# EAGLE design MiniKeyb (EAGLE 7.7.0)
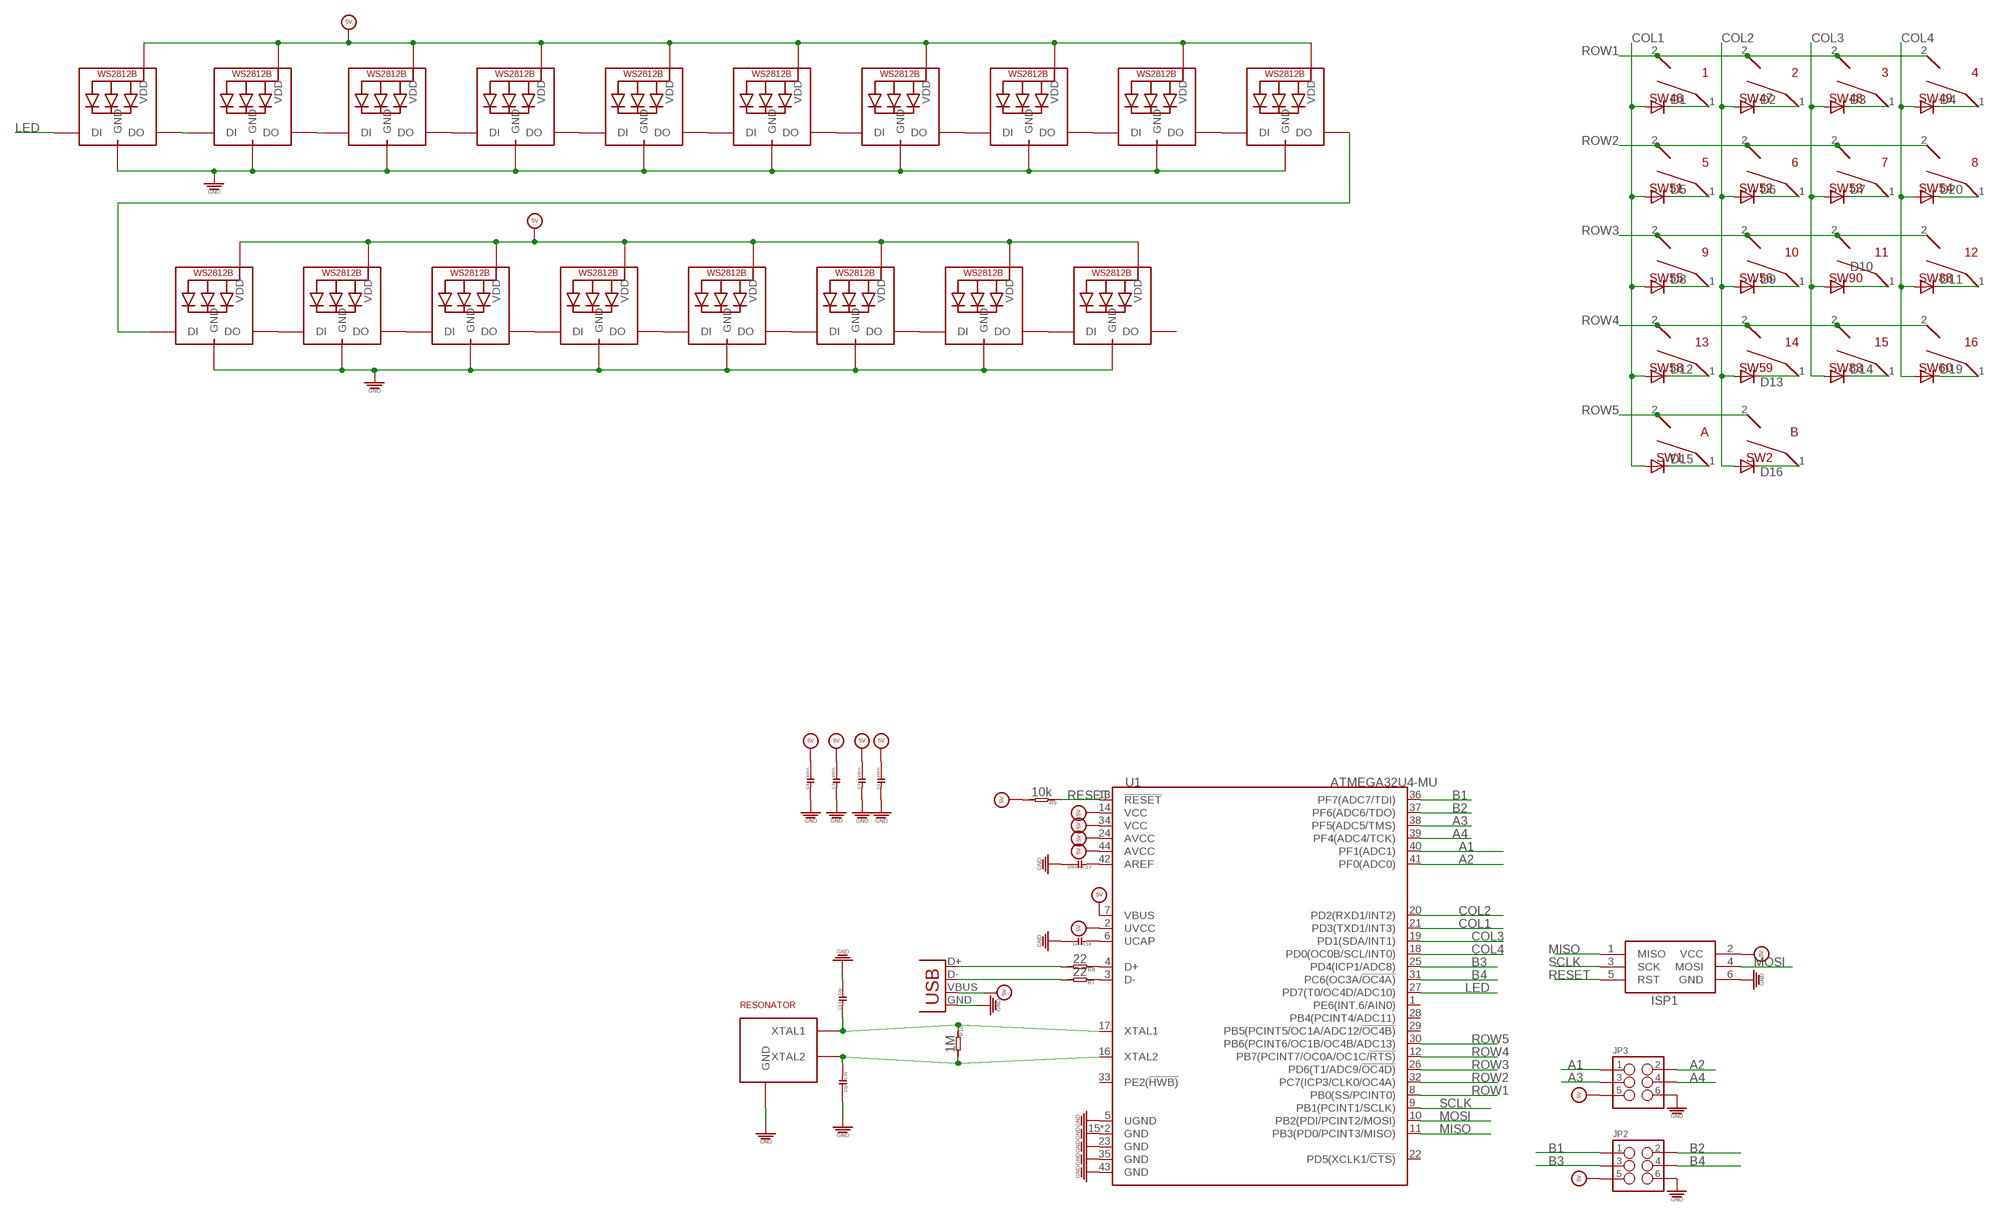
[diagram p0: schematic, sheet 1]

## Parts
C1  100n  C-0603  [C0603]
C2  100n  C-0603  [C0603]
C3  100n  C-0603  [C0603]
C4  100n  C-0603  [C0603]
C13  100n  C-0603  [C0603]
C14  1u  C-0603  [C0603]
C15  22p  C-0603  [C0603]
C16  22p  C-0603  [C0603]
D1  CGRM4001-G  [SOD-123_MINI-SMA]
D2  CGRM4001-G  [SOD-123_MINI-SMA]
D3  CGRM4001-G  [SOD-123_MINI-SMA]
D4  CGRM4001-G  [SOD-123_MINI-SMA]
D5  CGRM4001-G  [SOD-123_MINI-SMA]
D6  CGRM4001-G  [SOD-123_MINI-SMA]
D7  CGRM4001-G  [SOD-123_MINI-SMA]
D8  CGRM4001-G  [SOD-123_MINI-SMA]
D9  CGRM4001-G  [SOD-123_MINI-SMA]
D10  CGRM4001-G  [SOD-123_MINI-SMA]
D11  CGRM4001-G  [SOD-123_MINI-SMA]
D12  CGRM4001-G  [SOD-123_MINI-SMA]
D13  CGRM4001-G  [SOD-123_MINI-SMA]
D14  CGRM4001-G  [SOD-123_MINI-SMA]
D15  CGRM4001-G  [SOD-123_MINI-SMA]
D16  CGRM4001-G  [SOD-123_MINI-SMA]
D19  CGRM4001-G  [SOD-123_MINI-SMA]
D20  CGRM4001-G  [SOD-123_MINI-SMA]
ISP1  AVRISP-6  [AVRISP]
JP1  USB-B  USBPTH  [USB-B-PTH]
JP2  M03X2  [2X3-SHROUDED]
JP3  M03X2  [2X3-SHROUDED]
LED1  WS2812B3535  [LED3535]
LED2  WS2812B3535  [LED3535]
LED13  WS2812B3535  [LED3535]
LED14  WS2812B3535  [LED3535]
LED15  WS2812B3535  [LED3535]
LED16  WS2812B3535  [LED3535]
LED17  WS2812B3535  [LED3535]
LED18  WS2812B3535  [LED3535]
LED19  WS2812B3535  [LED3535]
LED20  WS2812B3535  [LED3535]
LED21  WS2812B3535  [LED3535]
LED22  WS2812B3535  [LED3535]
LED23  WS2812B3535  [LED3535]
LED24  WS2812B3535  [LED3535]
LED25  WS2812B3535  [LED3535]
LED26  WS2812B3535  [LED3535]
LED27  WS2812B3535  [LED3535]
LED28  WS2812B3535  [LED3535]
R7  22  R-0603  [R0603]
R8  22  R-0603  [R0603]
R9  10k  R-0603  [R0603]
R10  1M  R-0603  [R0603]
SW1  A  CHERRY_MX_WITH_FIXING_PINS  [MX1A-XXNW]
SW2  B  CHERRY_MX_WITH_FIXING_PINS  [MX1A-XXNW]
SW46  1  CHERRY_MX_WITH_FIXING_PINS  [MX1A-XXNW]
SW47  2  CHERRY_MX_WITH_FIXING_PINS  [MX1A-XXNW]
SW48  3  CHERRY_MX_WITH_FIXING_PINS  [MX1A-XXNW]
SW49  4  CHERRY_MX_WITH_FIXING_PINS  [MX1A-XXNW]
SW51  5  CHERRY_MX_WITH_FIXING_PINS  [MX1A-XXNW]
SW52  6  CHERRY_MX_WITH_FIXING_PINS  [MX1A-XXNW]
SW53  7  CHERRY_MX_WITH_FIXING_PINS  [MX1A-XXNW]
SW54  8  CHERRY_MX_WITH_FIXING_PINS  [MX1A-XXNW]
SW55  9  CHERRY_MX_WITH_FIXING_PINS  [MX1A-XXNW]
SW56  10  CHERRY_MX_WITH_FIXING_PINS  [MX1A-XXNW]
SW58  13  CHERRY_MX_WITH_FIXING_PINS  [MX1A-XXNW]
SW59  14  CHERRY_MX_WITH_FIXING_PINS  [MX1A-XXNW]
SW60  16  CHERRY_MX_WITH_FIXING_PINS  [MX1A-XXNW]
SW83  15  CHERRY_MX_WITH_FIXING_PINS  [MX1A-XXNW]
SW88  12  CHERRY_MX_WITH_FIXING_PINS  [MX1A-XXNW]
SW90  11  CHERRY_MX_WITH_FIXING_PINS  [MX1A-XXNW]
U1  ATMEGA32U4-MU  [QFN44]
U$60  RESONATOR  [16MHZXTAL]

## Nets
5V [power]: C1.2 C2.2 C3.2 C4.2 ISP1.2(VCC) JP1.VBUS JP2.5 JP3.5 LED1.1(VDD) LED2.1(VDD) LED13.1(VDD) LED14.1(VDD) LED15.1(VDD) LED16.1(VDD) LED17.1(VDD) LED18.1(VDD) LED19.1(VDD) LED20.1(VDD) LED21.1(VDD) LED22.1(VDD) LED23.1(VDD) LED24.1(VDD) LED25.1(VDD) LED26.1(VDD) LED27.1(VDD) LED28.1(VDD) R9.2 U1.2(UVCC) U1.7(VBUS) U1.14(VCC) U1.24(AVCC) U1.34(VCC) U1.44(AVCC)
A1: JP3.1 U1.40(PF1(ADC1))
A2: JP3.2 U1.41(PF0(ADC0))
A3: JP3.3 U1.38(PF5(ADC5/TMS))
A4: JP3.4 U1.39(PF4(ADC4/TCK))
B1: JP2.1 U1.36(PF7(ADC7/TDI))
B2: JP2.2 U1.37(PF6(ADC6/TDO))
B3: JP2.3 U1.25(PD4(ICP1/ADC8))
B4: JP2.4 U1.31(PC6(OC3A/!OC4A))
COL1: D1.A D5.A D8.A D12.A D15.A U1.21(PD3(TXD1/INT3))
COL2: D2.A D6.A D9.A D13.A D16.A U1.20(PD2(RXD1/INT2))
COL3: D3.A D7.A D10.A D14.A U1.19(PD1(SDA/INT1))
COL4: D4.A D11.A D19.A D20.A U1.18(PD0(OC0B/SCL/INT0))
GND: C1.1 C2.1 C3.1 C4.1 C13.2 C14.2 C15.2 C16.2 ISP1.6(GND) JP1.GND JP2.6 JP3.6 LED1.3(GND) LED2.3(GND) LED13.3(GND) LED14.3(GND) LED15.3(GND) LED16.3(GND) LED17.3(GND) LED18.3(GND) LED19.3(GND) LED20.3(GND) LED21.3(GND) LED22.3(GND) LED23.3(GND) LED24.3(GND) LED25.3(GND) LED26.3(GND) LED27.3(GND) LED28.3(GND) U1.5(UGND) U1.15(GND) U1.23(GND) U1.35(GND) U1.43(GND) U1.TAB(GND) U$60.P$2(GND) U$60.P$4(GND)
LED: LED13.4(DI) U1.27(PD7(T0/OC4D/ADC10))
MISO: ISP1.1(MISO) U1.11(PB3(PD0/PCINT3/MISO))
MOSI: ISP1.4(MOSI) U1.10(PB2(PDI/PCINT2/MOSI))
N$1: D1.C SW46.1
N$2: D2.C SW47.1
N$3: D3.C SW48.1
N$4: D4.C SW49.1
N$5: D5.C SW51.1
N$6: D6.C SW52.1
N$7: D7.C SW53.1
N$8: D8.C SW55.1
N$9: D9.C SW56.1
N$10: D10.C SW90.1
N$11: D11.C SW88.1
N$12: D12.C SW58.1
N$13: D13.C SW59.1
N$14: D14.C SW83.1
N$15: D15.C SW1.1
N$16: D16.C SW2.1
N$17: LED1.2(DO) LED2.4(DI)
N$18: LED1.4(DI) LED28.2(DO)
N$19: D19.C SW60.1
N$20: D20.C SW54.1
N$48: LED13.2(DO) LED14.4(DI)
N$70: LED14.2(DO) LED15.4(DI)
N$71: LED15.2(DO) LED16.4(DI)
N$72: LED16.2(DO) LED17.4(DI)
N$73: LED18.2(DO) LED19.4(DI)
N$74: LED19.2(DO) LED20.4(DI)
N$75: LED20.2(DO) LED21.4(DI)
N$76: LED21.2(DO) LED22.4(DI)
N$77: LED17.2(DO) LED18.4(DI)
N$78: LED27.2(DO) LED28.4(DI)
N$80: LED23.2(DO) LED24.4(DI)
N$81: LED24.2(DO) LED25.4(DI)
N$82: LED25.2(DO) LED26.4(DI)
N$83: LED26.2(DO) LED27.4(DI)
N$90: LED22.2(DO) LED23.4(DI)
N$99: JP1.D- R7.2
N$100: JP1.D+ R8.2
N$110: C13.1 U1.42(AREF)
N$111: R8.1 U1.4(D+)
N$117: R7.1 U1.3(D-)
N$118: C14.1 U1.6(UCAP)
N$119: C15.1 R10.1 U1.17(XTAL1) U$60.P$1(XTAL1)
N$120: C16.1 R10.2 U1.16(XTAL2) U$60.P$3(XTAL2)
RESET: ISP1.5(RST) R9.1 U1.13(!RESET)
ROW1: SW46.2 SW47.2 SW48.2 SW49.2 U1.8(PB0(SS/PCINT0))
ROW2: SW51.2 SW52.2 SW53.2 SW54.2 U1.32(PC7(ICP3/CLK0/OC4A))
ROW3: SW55.2 SW56.2 SW88.2 SW90.2 U1.26(PD6(T1/ADC9/!OC4D))
ROW4: SW58.2 SW59.2 SW60.2 SW83.2 U1.12(PB7(PCINT7/OC0A/OC1C/!RTS))
ROW5: SW1.2 SW2.2 U1.30(PB6(PCINT6/OC1B/OC4B/ADC13))
SCLK: ISP1.3(SCK) U1.9(PB1(PCINT1/SCLK))
Unconnected: LED2.2(DO) U1.1(PE6(INT.6/AIN0)) U1.22(PD5(XCLK1/!CTS)) U1.28(PB4(PCINT4/ADC11)) U1.29(PB5(PCINT5/OC1A/ADC12/!OC4B)) U1.33(PE2(!HWB))

## Library data of the parts
C1-C4 C13-C16 = OPL:C*
D1-D16 D19 D20 = diode:CGRM400*-G: Molded plasitc,JEDEC SOD-123/Mini SMA Source: Comchip CGRM4001-G.pdf
ISP1 = adafruit:AVRISP: AVR ISP HEADER Standard 6 pin header for AVR programming
JP1 = SparkFun-Connectors:USB: USB Connectors USB-B-PTH is fully proven SKU : PRT-00139/CONN-08278 USB-miniB is fully proven SKU : PRT-00587 USB-A-PCB is untested. USB-A-H is throughly reviewed, but untested. Spark Fun Electronics SKU : PRT-00437 USB-B-SMT is throughly reviewed, but untested. Needs silkscreen touching up. USB-A-S has not been used/tested USB-MB-H has not been used/tested USB-MICROB has been used. CONN-09505; PROD_ID: CONN-08278
JP2 JP3 = SparkFun-Connectors:M03X2: 2x3 .1" header. Shrouded, with keying- CONN-10681 SMT- CONN-11415 Pogo pins- HW-11044; PROD_ID: CONN-10681
LED1 LED2 LED13-LED28 = EurorackModularParts:WS2812B
R7-R10 = OPL:R*
SW1 SW2 SW46-SW49 SW51-SW56 SW58-SW60 SW83 SW88 SW90 = Cherry_MX_v7.0:CHERRY_MX
U1 = IC:ATMEGA32U4: 8-bit Microcontroller With 16/32K Bytes of ISP Flash and USB controller
U$60 = EurorackModularParts:RESONATOR

## Net classes
0 default: width 0.254 mm
1 power: width 0.381 mm

## Board
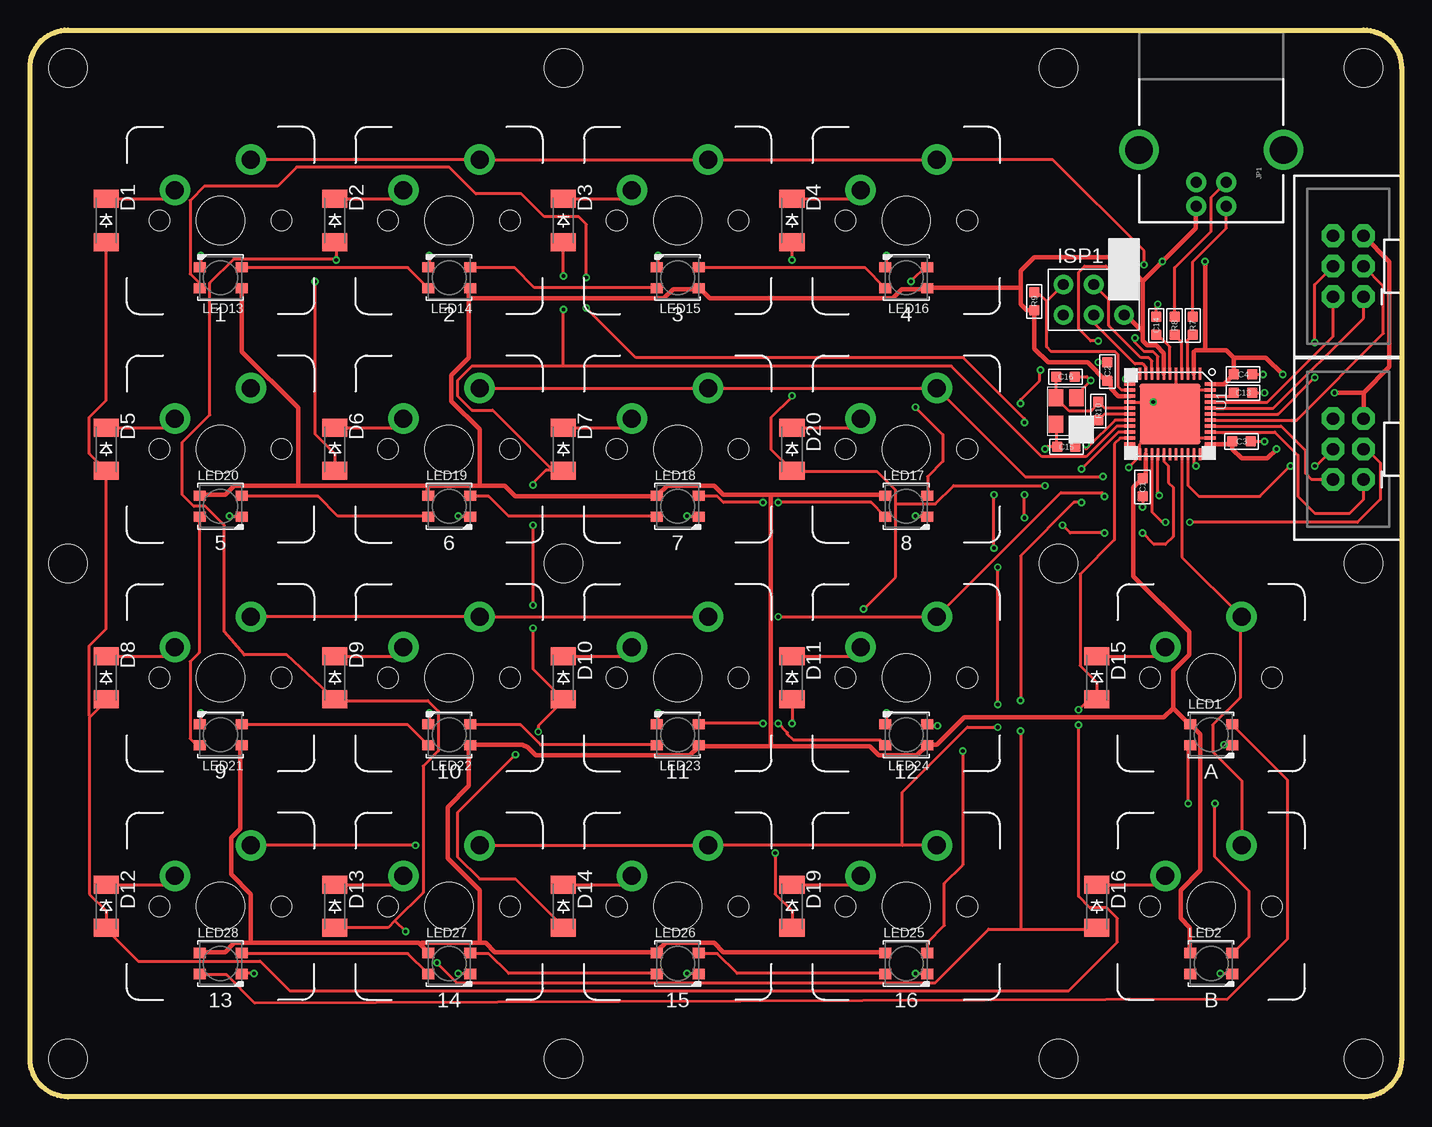
[diagram p1: board, top side]
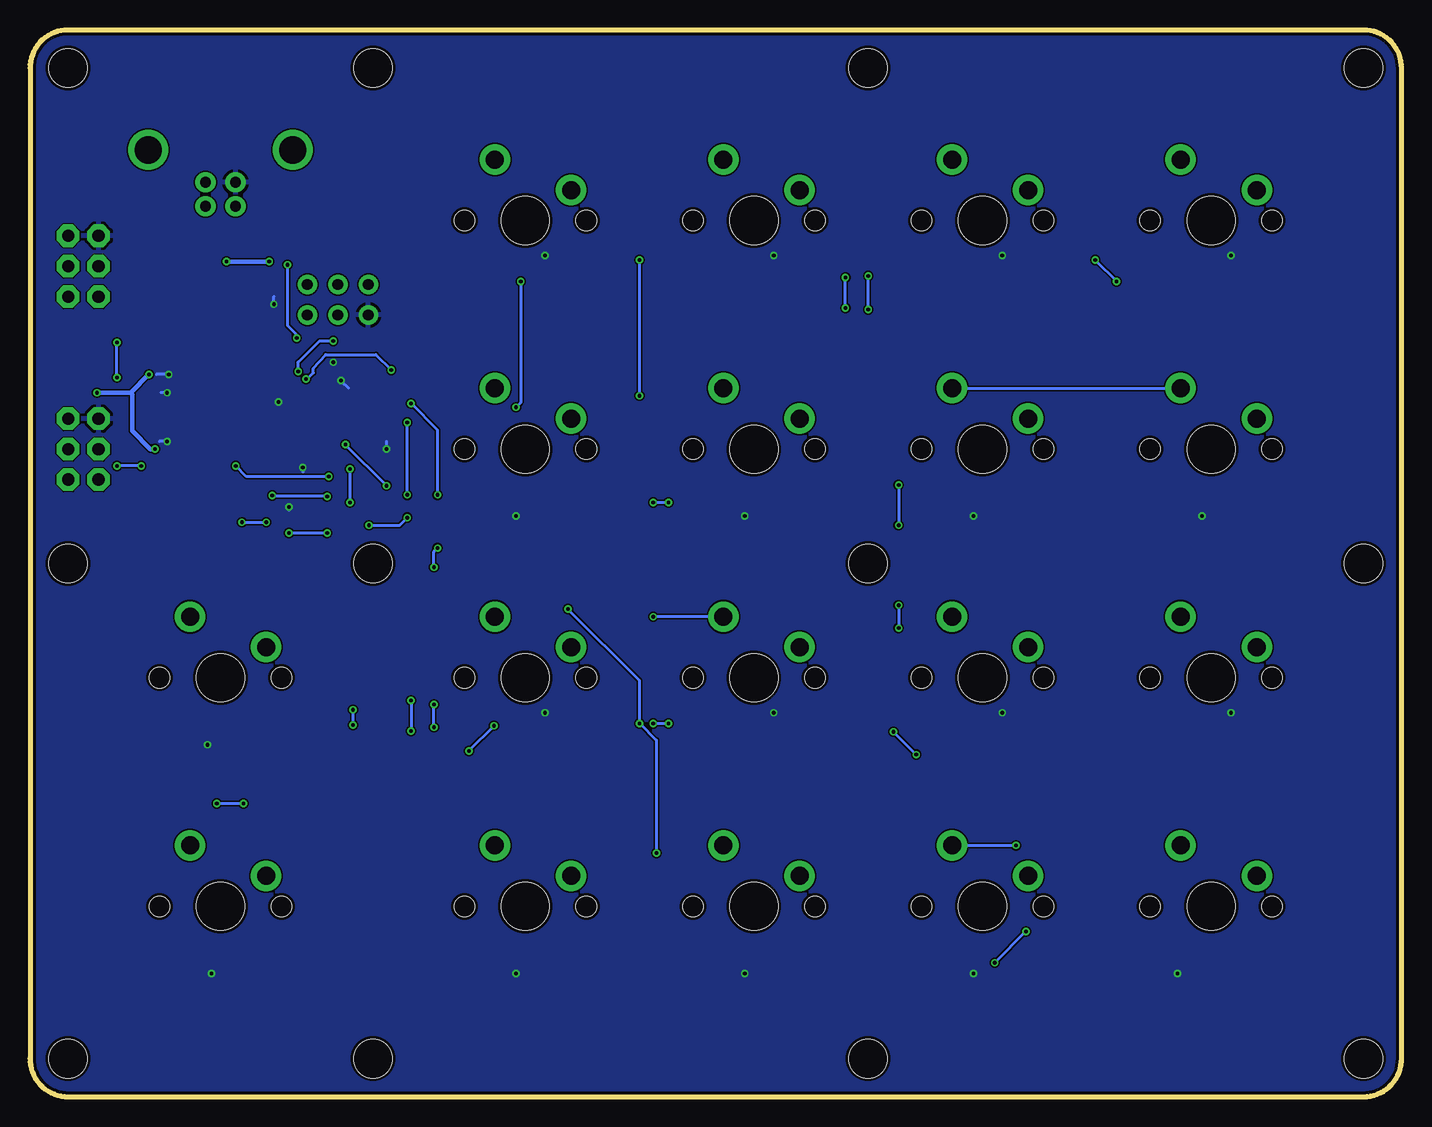
[diagram p2: board, bottom side, seen from below]

Size 114.3 x 88.9 mm. Coordinates in mm from the lower left corner, seen from the top.
Outline: 3.17,88.9 111.12,88.9 arc-90 114.3,85.72 114.3,3.17 arc-90 111.12,0 3.17,0 arc-90 0,3.17 0,85.72 arc-90 3.17,88.9
Copper layers (1*16): Top 0.035mm / dielectric 1.5mm / Bottom 0.035mm
Design rules "dirt_cheap_dirty_boards.v1": minimum track width 5mil, minimum drill 12mil, track to track 5mil, track to pad 5mil, pad to pad 5mil, via to via 5mil, smd to smd 0mil, copper to edge 10mil, drill to drill 10mil, minimum pad ring 10mil, minimum via ring 6mil, stop-mask expansion 2mil, vias tented up to drill 25mil, thermal gap 10mil
Holes 3.2 mm at 3.17,85.72 3.17,3.17 85.72,44.45 85.72,85.72 3.17,44.45 111.12,3.17 44.45,3.17 111.12,44.45 111.12,85.72 85.72,3.17 44.45,85.72 44.45,44.45

### Footprints (pad centres in the part's own frame; a part is rotated, then mirrored left to right if it is on the bottom)
C0603 = smd 0.889 x 0.889: 1 -0.762,0; 2 0.762,0
SOD-123_MINI-SMA = smd 1.5 x 2.1: A 1.8,0; C -1.8,0
AVRISP = drill 0.9 pad 1.626: 1 -1.27,2.54; 2 1.27,2.54; 3 -1.27,0; 4 1.27,0; 5 -1.27,-2.54; 6 1.27,-2.54
USB-B-PTH = drill 0.914 pad 1.676: D+ 0,1.25; D- 1.981,1.25; GND 0,-1.25; VBUS 1.981,-1.25 | drill 2.286: S1 -2.718,-6.02; S2 -2.718,6.02
2X3-SHROUDED = drill 1.016 pad 1.88 octagon: 1 -1.27,2.54; 2 1.27,2.54; 3 -1.27,0; 4 1.27,0; 5 -1.27,-2.54; 6 1.27,-2.54
LED3535 = smd 1 x 0.85: 1 -1.75,0.875; 2 -1.75,-0.875; 3 1.75,-0.875; 4 1.75,0.875
R0603 = smd 0.889 x 0.889: 1 -0.762,0; 2 0.762,0
MX1A-XXNW = drill 1.5 pad 2.54: 1 -3.81,2.54; 2 2.54,5.08 | hole 4: 0,0 | hole 1.7: -5.08,0; 5.08,0
QFN44 = smd 1 x 0.3: 1 -3.35,2.5; 2 -3.35,2; 3 -3.35,1.5; 4 -3.35,1; 5 -3.35,0.5; 6 -3.35,0; 7 -3.35,-0.5; 8 -3.35,-1; 9 -3.35,-1.5; 10 -3.35,-2; 11 -3.35,-2.5; 23 3.35,-2.5; 24 3.35,-2; 25 3.35,-1.5; 26 3.35,-1; 27 3.35,-0.5; 28 3.35,0; 29 3.35,0.5; 30 3.35,1; 31 3.35,1.5; 32 3.35,2; 33 3.35,2.5 | smd 0.3 x 1: 12 -2.5,-3.35; 13 -2,-3.35; 14 -1.5,-3.35; 15 -1,-3.35; 16 -0.5,-3.35; 17 0,-3.35; 18 0.5,-3.35; 19 1,-3.35; 20 1.5,-3.35; 21 2,-3.35; 22 2.5,-3.35; 34 2.5,3.35; 35 2,3.35; 36 1.5,3.35; 37 1,3.35; 38 0.5,3.35; 39 0,3.35; 40 -0.5,3.35; 41 -1,3.35; 42 -1.5,3.35; 43 -2,3.35; 44 -2.5,3.35 | smd 5.08 x 5.08: TAB 0,0
16MHZXTAL = smd 1.4 x 1.2: P$1 -1.1,-0.85; P$2 1.1,-0.85; P$3 1.1,0.85; P$4 -1.1,0.85

### Placement (x,y rotation side)
C1  92.71,50.8 90 top
C2  89.79,60.45 270 top
C3  100.97,54.61 180 top
C4  101.09,60.2 180 top
C13  101.09,58.67 0 top
C14  93.85,64.26 90 top
C15  86.36,54.17 180 top
C16  86.3,60.01 0 top
D1  6.35,73.03 270 top
D2  25.4,73.03 270 top
D3  44.45,73.03 270 top
D4  63.5,73.03 270 top
D5  6.35,53.97 270 top
D6  25.4,53.97 270 top
D7  44.45,53.97 270 top
D8  6.35,34.92 270 top
D9  25.4,34.92 270 top
D10  44.45,34.92 270 top
D11  63.5,34.92 270 top
D12  6.35,15.88 270 top
D13  25.4,15.88 270 top
D14  44.45,15.88 270 top
D15  88.9,34.92 270 top
D16  88.9,15.88 270 top
D19  63.5,15.88 270 top
D20  63.5,53.97 270 top
ISP1  88.65,66.42 270 top
JP1  98.42,76.2 270 top
JP2  109.86,53.97 180 top
JP3  109.86,69.22 180 top
LED1  98.42,30.16 0 top
LED2  98.42,11.11 0 top
LED13  15.88,68.26 180 top
LED14  34.92,68.26 180 top
LED15  53.97,68.26 180 top
LED16  73.02,68.26 180 top
LED17  73.02,49.21 0 top
LED18  53.97,49.21 0 top
LED19  34.92,49.21 0 top
LED20  15.88,49.21 0 top
LED21  15.88,30.16 180 top
LED22  34.92,30.16 180 top
LED23  53.97,30.16 180 top
LED24  73.02,30.16 180 top
LED25  73.02,11.11 0 top
LED26  53.97,11.11 0 top
LED27  34.92,11.11 0 top
LED28  15.88,11.11 0 top
R7  96.9,64.26 90 top
R8  95.38,64.26 90 top
R9  83.69,66.29 270 top
R10  89.03,57.15 90 top
SW1  98.42,34.92 0 top
SW2  98.42,15.88 0 top
SW46  15.88,73.03 0 top
SW47  34.92,73.03 0 top
SW48  53.97,73.03 0 top
SW49  73.02,73.03 0 top
SW51  15.88,53.97 0 top
SW52  34.92,53.97 0 top
SW53  53.97,53.97 0 top
SW54  73.02,53.97 0 top
SW55  15.88,34.92 0 top
SW56  34.92,34.92 0 top
SW58  15.88,15.88 0 top
SW59  34.92,15.88 0 top
SW60  73.02,15.88 0 top
SW83  53.97,15.88 0 top
SW88  73.02,34.92 0 top
SW90  53.97,34.92 0 top
U1  95,56.9 270 top
U$60  86.36,57.15 90 top

### Tracks (layer width: path | path; a pad name or v marks a point on that pad's centre or on a via)
5V  (via drill 0.3)
  Top 0.381: U1.34 99.99,54.4 C3.2 100.2,53.97 100.97,53.21 103.12,53.21 v103.89,53.97 | U1.44 99.53,59.4 C4.2 | U1.2 97,62.07 97.16,62.23 97.92,62.23 | 97.92,62.23 99.69,62.23 100.33,61.59 C4.2 | U1.7 94.5,61.97 93.85,62.61 93.09,62.61 92.71,62.99 92.71,63.75 | 92.71,63.75 91.31,65.15 ISP1.2 | 92.71,63.75 92.71,67.94 | 92.71,67.94 v94.36,69.6 97.16,72.39 97.16,74.2 JP1.VBUS | U1.14 90.7,58.4 90.04,59.06 90.04,59.69 C2.2 89.66,59.69 88.14,61.21 84.84,61.21 83.69,62.36 R9.2 83.06,65.53 82.55,66.04 82.55,67.44 | JP2.5 111.12,58.67 | 111.12,58.67 113.28,60.83 113.28,69.6 JP3.5 | U1.24 93,51.85 C1.2 91.95,50.8 91.95,43.37 96.58,38.73 96.58,36.83 95.25,35.5 95.25,32.39 | 82.55,67.44 82.55,68.83 83.69,69.98 90.68,69.98 92.71,67.94 | v97.92,69.6 97.92,62.23 | C4.2 100.33,61.47 100.46,61.59 103,61.59 v104.39,60.2 | v108.71,58.67 111.12,58.67 | 18.41,12.83 32.38,12.83 32.51,12.7 | 18.41,12.83 17.02,12.83 16.26,12.06 14.22,12.06 LED28.1 | 32.51,12.7 33.15,12.06 LED27.1 | 18.41,12.83 18.41,16.89 16.76,18.54 16.76,21.59 17.53,22.35 17.53,29.21 LED21.1 | 37.46,12.83 32.64,12.83 32.51,12.7 | 37.46,12.83 37.97,12.83 38.73,12.06 52.2,12.06 LED26.1 52.32,12.19 52.96,12.83 57.02,12.83 57.78,12.06 71.25,12.06 LED25.1 | 37.46,12.83 37.46,17.21 34.8,19.88 34.8,24.13 36.58,25.91 36.58,29.21 LED22.1 36.83,29.34 41.02,29.34 41.47,29.15 42.16,28.45 54.99,28.45 55.63,29.08 LED23.1 55.75,29.21 61.72,29.21 | LED2.1 96.65,12.06 96.65,14.1 95.88,14.86 95.88,17.21 97.54,18.86 97.54,30.23 96.77,30.99 LED1.1 96.52,31.11 95.25,32.39 | 61.72,29.21 69.98,29.21 70.74,28.45 73.91,28.45 74.68,29.21 LED24.1 74.93,29.34 75.56,29.34 77.85,31.62 94.49,31.62 95.25,32.39
  Top 0.381: 82.55,67.44 74.8,67.44 LED16.1 74.68,67.31 72.64,67.31 71.88,66.55 56.64,66.55 55.88,67.31 LED15.1 55.63,67.31 53.59,67.31 52.83,66.55 36.58,66.55 | 32.96,50.93 22.35,50.93 | 22.35,50.93 17.02,50.93 16.26,50.17 14.22,50.17 LED20.1 | 33.15,50.8 33.15,50.17 LED19.1 | 33.15,50.8 33.34,50.93 | 32.96,50.93 33.34,50.93 | 33.34,50.93 37.46,50.93 | 37.46,50.93 39.56,50.93 40.45,50.04 52.2,50.04 LED18.1 52.32,50.17 53.09,50.93 57.02,50.93 57.78,50.17 61.72,50.17 | 32.96,50.93 33.15,50.8 | 61.72,50.17 71.25,50.17 LED17.1 | 22.35,50.93 22.35,57.4 17.65,62.1 17.65,67.31 LED13.1 | 36.58,66.55 36.58,61.59 35.12,60.14 35.12,57.97 37.46,55.63 37.46,50.93 | 36.58,66.55 36.58,67.31 LED14.1 | 61.72,50.17 61.72,29.21
  Bottom 0.381: v94.36,69.6 v97.92,69.6 | v104.39,60.2 105.92,58.67 | 105.92,58.67 v108.71,58.67 | v103.89,53.97 104.27,53.97 105.79,55.5 105.79,58.55 105.92,58.67
A1
  Top 0.254: U1.40 103.62,57.4 111.12,64.9 JP3.1
A2
  Top 0.254: U1.41 103.11,57.9 108.58,63.37 JP3.2
A3
  Top 0.254: U1.38 105.55,56.4 112.78,63.63 112.78,67.56 JP3.3
A4  (via drill 0.3)
  Top 0.254: U1.39 104.01,56.9 v107.06,59.94 | JP3.4 107.06,67.69 v107.06,62.86
  Bottom 0.254: v107.06,59.94 v107.06,62.86
B1
  Top 0.254: U1.36 103.73,55.4 105.66,53.47 105.66,50.04 107.06,48.64 109.98,48.64 111.12,49.78 JP2.1
B2
  Top 0.254: U1.37 104.25,55.9 106.3,53.85 106.3,51.94 106.81,51.44 JP2.2
B3  (via drill 0.3)
  Top 0.254: JP2.3 111.38,53.97 112.52,52.83 112.52,49.78 110.62,47.88 v96.65,47.88 | v94.61,47.88 94.36,47.88 93.5,48.74 U1.25
  Bottom 0.254: v96.65,47.88 v94.61,47.88
B4  (via drill 0.3)
  Top 0.254: U1.31 96.5,50.95 97.41,50.04 102.49,50.04 v105.03,52.58 | v107.06,52.58 107.19,52.58 JP2.4
  Bottom 0.254: v105.03,52.58 v107.06,52.58
COL1  (via drill 0.3)
  Top 0.254: U1.21 90.84,54.9 90.36,54.42 90.36,46.42 87.5,43.56 87.5,35.94 88.9,34.54 D15.A 88.9,33.02 88.14,33.02 v87.38,32.26 | 5.02,31.69 6.35,33.02 D8.A | 5.02,31.69 4.95,31.62 4.95,16.89 6.35,15.49 D12.A 6.35,13.97 9.02,11.3 19.18,11.3 21.65,8.83 86.55,8.83 90.61,12.89 90.61,14.86 89.72,15.75 88.33,15.75 87.38,16.7 v87.38,30.99 | 5.02,31.69 4.95,31.75 4.95,37.59 6.35,38.99 D5.A 6.35,52.2 4.95,53.59 4.95,56.64 6.35,58.04 D1.A
  Bottom 0.254: v87.38,30.99 v87.38,32.26
COL2  (via drill 0.3)
  Top 0.254: U1.20 90.7,55.4 v87.63,52.32 | D6.A 25.4,53.59 23.75,55.25 v23.75,67.94 | 25.53,69.85 25.53,70.99 25.4,71.12 D2.A | 30.42,14.67 32.77,17.02 32.77,27.56 34.04,28.83 34.04,32.13 33.15,33.02 25.4,33.02 D9.A 25.4,33.15 21.4,36.83 17.84,36.83 16.19,38.73 16.19,47.62 14.61,49.21 13.65,49.21 12.7,50.17 12.7,54.55 14.99,56.83 14.99,67.82 17.02,69.85 25.53,69.85 | 30.42,14.67 29.85,14.1 25.4,14.1 D13.A | 82.55,13.97 79.88,13.97 75.44,9.52 35.56,9.52 v33.91,11.18 | 82.55,13.97 88.9,13.97 D16.A | 30.42,14.67 v31.31,13.78 | 25.53,69.85 v25.53,69.72 | v87.63,49.53 86.99,49.53 82.55,45.08 v82.55,33.02 | v82.55,30.48 82.55,13.97
  Bottom 0.254: v25.53,69.72 v23.75,67.94 | v31.31,13.78 v33.91,11.18 | v87.63,49.53 v87.63,52.32 | v82.55,33.02 v82.55,30.48
COL3  (via drill 0.3)
  Top 0.254: U1.19 90.57,55.9 88.01,53.34 84.33,53.34 76.77,60.9 44.45,60.9 | v40.45,28.51 35.62,23.69 35.62,20 37.46,18.16 40.45,18.16 44.51,14.1 44.45,14.1 D14.A | v42.35,30.42 42.35,30.92 44.45,33.02 D10.A 41.91,35.67 v41.91,39.05 | 44.45,60.9 36.83,60.9 35.62,59.69 35.62,58.42 36.83,57.21 38.54,57.21 43.56,52.2 44.45,52.2 D7.A 43.43,52.2 42.99,52.2 41.91,51.12 v41.91,50.99 | v44.45,68.39 D3.A | 44.45,60.9 v44.45,65.6 | v41.91,47.62 v41.91,40.96
  Bottom 0.254: v40.45,28.51 v42.35,30.42 42.23,30.42 | v44.45,65.6 v44.45,68.39 | v41.91,50.99 v41.91,47.62 | v41.91,40.96 v41.91,39.05
COL4  (via drill 0.3)
  Top 0.254: U1.18 90.43,56.4 88.2,54.17 | 88.2,54.17 88.01,53.97 | D19.A 63.5,15.49 62.1,16.89 v62.1,20.32 | D11.A v63.5,31.11 | 72.14,49.4 72.14,43.31 v69.47,40.64 | 72.14,49.4 72.14,50.55 70.61,52.07 63.5,52.07 D20.A 63.5,52.2 61.79,53.91 61.79,56.64 63.5,58.36 v63.5,58.42 | v63.5,69.72 D4.A | v88.01,54.36 88.2,54.17 | v84.58,50.93 76.96,50.93 75.44,49.4 72.14,49.4
  Bottom 0.254: v62.1,20.32 62.1,29.72 v63.5,31.11 63.5,34.67 v69.47,40.64 | v63.5,58.42 v63.5,69.72 | v84.58,50.93 v88.01,54.36
GND  (via drill 0.3)
  Top 0.254: U1.5 95.5,57.4 U1.TAB | U1.35 97,54.9 U1.TAB | U1.TAB 94,57.9 U1.15 93.58,57.9 v93.6,57.91 | U1.TAB 92.5,54.4 U1.23 92.5,53.38 v91.57,52.45 | C16.2 88.08,60.01 v88.39,59.69 87.21,58.51 U$60.P$2 | U$60.P$4 85.51,54.25 C15.2 84.77,54.17 v84.58,53.97 | U1.43 97,58.9 U1.TAB | C13.2 v102.87,58.67 | C4.1 v102.74,60.2 | C3.1 v102.87,54.61 | C14.2 93.85,65.91 v93.98,66.04 | C2.1 v89.03,61.21 | C1.1 v92.71,49.15 | v14.22,32 14.22,31.11 LED21.3 | v18.67,10.29 17.65,10.29 LED28.3 | v33.27,32 33.27,31.11 LED22.3 | v35.69,10.29 36.58,10.29 LED27.3 | v52.32,32 52.32,31.11 LED23.3 | v14.22,70.1 14.22,69.22 LED13.3 | v54.74,10.29 55.63,10.29 LED26.3 | v71.37,32 71.37,31.11 LED24.3 | v16.64,48.39 17.53,48.39 LED20.3 | v33.27,70.1 33.27,69.22 LED14.3 | v73.79,10.29 74.68,10.29 LED25.3 | v99.19,10.29 100.08,10.29 LED2.3 | v35.69,48.39 36.58,48.39 LED19.3 | v52.32,70.1 52.32,69.22 LED15.3 | v54.74,48.39 55.63,48.39 LED18.3 | v73.79,48.39 74.68,48.39 LED17.3 | v99.5,29.34 100.08,29.34 LED1.3 | v71.37,70.1 71.37,69.22 LED16.3
  Bottom 0.254: v88.39,59.69 87.76,59.06 | v84.58,53.97 84.58,54.61 | v102.87,58.67 103.38,58.67 | v102.74,60.2 103.76,60.2 | v102.87,54.61 103.5,54.61 | v93.98,66.04 93.98,66.67 | v91.57,52.45 91.57,52.07 | v92.71,49.15 92.71,48.89 | v93.6,57.91 93.73,57.91
  pour Bottom: -3.17,90.49 115.89,90.49 115.89,0 arc-90 112.71,-3.17 -3.17,-3.17
LED  (via drill 0.3)
  Top 0.254: LED13.4 14.1,67.44 14.1,67.82 13.34,68.58 13.34,74.68 14.57,75.91 14.61,75.88 20.64,75.88 22.23,77.47 34.92,77.47 37.15,75.25 40.96,75.25 42.86,73.34 45.72,73.34 46.35,72.71 v46.35,68.26 | U1.27 94.49,53.47 94.49,52.96 94.87,52.58 94.87,51.18 95.25,50.8 95.25,46.67 94.61,46.04 93.66,46.04 v92.71,46.99 | v89.53,46.99 86.68,46.99 v86.04,47.62 | v82.87,48.26 v82.87,50.17 | v82.87,56.2 82.87,56.52 77.79,61.59 50.48,61.59 v46.35,65.72
  Bottom 0.254: v92.71,46.99 v89.53,46.99 | v86.04,47.62 83.5,47.62 v82.87,48.26 | v82.87,50.17 v82.87,56.2 | v46.35,65.72 v46.35,68.26
MISO  (via drill 0.3)
  Top 0.254: U1.11 92.15,60.25 v91.95,60.45 | v89.03,62.99 88.39,62.99 87.38,64.01 87.38,68.71 87.88,69.22 89.66,69.22 ISP1.1
  Bottom 0.254: v91.95,60.45 91.95,61.21 90.17,62.99 v89.03,62.99
MOSI
  Top 0.254: U1.10 93,60.8 92.71,61.09 92.08,61.09 88.65,64.52 ISP1.4
N$1
  Top 0.254: D1.C 11.32,74.83 SW46.1
N$2
  Top 0.254: D2.C 30.38,74.83 SW47.1
N$3
  Top 0.254: D3.C 49.42,74.83 SW48.1
N$4
  Top 0.254: D4.C 68.47,74.83 SW49.1
N$5
  Top 0.254: D5.C 11.32,55.78 SW51.1
N$6
  Top 0.254: D6.C 30.38,55.78 SW52.1
N$7
  Top 0.254: D7.C 49.42,55.78 SW53.1
N$8
  Top 0.254: D8.C 11.32,36.72 SW55.1
N$9
  Top 0.254: D9.C 30.38,36.72 SW56.1
N$10
  Top 0.254: D10.C 49.42,36.72 SW90.1
N$11
  Top 0.254: D11.C 68.47,36.72 SW88.1
N$12
  Top 0.254: D12.C 11.32,17.67 SW58.1
N$13
  Top 0.254: D13.C 30.38,17.67 SW59.1
N$14
  Top 0.254: D14.C 49.42,17.67 SW83.1
N$15
  Top 0.254: D15.C 93.88,36.72 SW1.1
N$16
  Top 0.254: D16.C 93.88,17.67 SW2.1
N$17  (via drill 0.3)
  Top 0.254: LED2.4 100.08,11.94 100.2,11.94 101.6,13.34 101.6,17.14 98.74,20 v98.74,24.45 | 96.65,29.21 LED1.2 96.52,29.13 v96.52,24.45
  Bottom 0.254: v98.74,24.45 v96.52,24.45
N$18
  Top 0.254: LED28.2 14.22,10.16 16.38,10.16 18.73,7.81 99.76,8.13 104.77,13.15 104.77,26.42 100.2,30.99 LED1.4
N$19
  Top 0.254: D19.C 68.47,17.67 SW60.1
N$20
  Top 0.254: D20.C 68.47,55.78 SW54.1
N$48
  Top 0.254: LED13.2 17.65,69.09 31.5,69.09 33.15,67.44 LED14.4
N$70
  Top 0.254: LED14.2 36.7,69.09 40.39,69.09 42.04,67.44 52.2,67.44 LED15.4
N$71
  Top 0.254: LED15.2 55.75,69.09 69.6,69.09 71.25,67.44 LED16.4
N$72  (via drill 0.3)
  Top 0.254: v73.79,57.47 76.07,55.18 76.07,52.96 74.8,51.69 74.8,50.17 LED17.4 | v73.41,67.94 74.68,69.22 LED16.2
  Bottom 0.254: v73.79,57.47 73.41,57.85 v73.41,67.94
N$73
  Top 0.254: LED19.4 36.7,50.04 38.23,50.04 39.88,48.39 52.2,48.39 LED18.2
N$74
  Top 0.254: LED20.4 17.65,50.04 24,50.04 25.65,48.39 33.15,48.39 LED19.2
N$75
  Top 0.254: LED21.4 14.1,29.34 14.1,29.08 13.34,29.84 13.34,36.26 14.1,37.02 14.1,48.26 LED20.2
N$76
  Top 0.254: LED21.2 17.65,30.99 31.5,30.99 33.15,29.34 LED22.4
N$77  (via drill 0.3)
  Top 0.254: v61.09,49.53 57.78,49.53 57.28,50.04 55.75,50.04 LED18.4 | v62.36,49.53 70.1,49.53 71.25,48.39 LED17.2
  Bottom 0.254: v62.36,49.53 v61.09,49.53
N$78
  Top 0.254: LED28.4 17.65,11.94 31.5,11.94 33.15,10.29 LED27.2
N$80  (via drill 0.3)
  Top 0.254: v61.09,31.11 55.75,31.11 LED23.2 | v62.36,31.11 63.12,30.35 63.12,30.23 63.63,29.72 70.87,29.72 71.25,29.34 LED24.4
  Bottom 0.254: v62.36,31.11 v61.09,31.11
N$81  (via drill 0.3)
  Top 0.254: v77.72,28.83 77.72,19.3 76.2,17.78 76.2,14.29 74.8,12.89 74.8,12.06 LED25.4 | v75.63,30.92 75.18,30.92 74.8,30.99 LED24.2
  Bottom 0.254: v75.63,30.92 v77.72,28.83
N$82
  Top 0.254: LED26.4 55.75,11.94 57.28,11.94 58.93,10.29 71.25,10.29 LED25.2
N$83
  Top 0.254: LED27.4 36.7,11.94 38.23,11.94 39.88,10.29 52.2,10.29 LED26.2
N$90
  Top 0.254: LED22.2 36.7,30.99 40.89,30.99 42.54,29.34 52.2,29.34 LED23.4
N$99
  Top 0.254: R7.2 96.9,69.6 99.69,72.39 JP1.D-
N$100
  Top 0.254: R8.2 95.38,69.09 98.42,72.14 98.42,74.95 JP1.D+
N$110
  Top 0.254: U1.42 100.18,58.4 C13.1
N$111
  Top 0.254: U1.4 96,62.88 R8.1
N$117
  Top 0.254: U1.3 96.5,63.09 R7.1
N$118
  Top 0.254: U1.6 95,62.48 93.98,63.5 93.98,63.37 C14.1
N$119
  Top 0.254: U1.17 89.53,56.9 R10.1 88.69,56.05 U$60.P$1 87.21,54.25 C15.1
N$120
  Top 0.254: U1.16 89.54,57.4 R10.2 89.03,57.78 88.39,57.15 86.61,57.15 U$60.P$3 85.51,59.98 C16.1
RESET
  Top 0.254: U1.13 90.96,58.9 90.68,59.18 90.68,61.85 90.42,62.1 85.09,62.1 84.71,62.48 84.71,66.29 | 84.71,66.29 ISP1.5 | R9.1 83.95,67.06 84.71,66.29
ROW1  (via drill 0.3)
  Top 0.254: U1.8 94,61.71 93.6,62.1 92.84,62.1 92.08,62.86 v92.08,63.25 | v92.84,69.34 92.84,70.48 85.22,78.11 SW49.2 SW48.2 SW47.2 SW46.2
  Bottom 0.254: v92.08,63.25 92.08,63.5 92.84,64.26 v92.84,69.34
ROW2  (via drill 0.3)
  Top 0.254: v97.16,52.58 97.03,52.7 97.03,53.47 U1.32 | v89.41,51.69 82.93,51.69 SW54.2 SW53.2 SW52.2
  Bottom 0.254: v97.16,52.58 96.27,51.69 v89.41,51.69 | SW52.2 SW51.2
ROW3  (via drill 0.3)
  Top 0.254: v94.11,50.1 93.98,50.23 93.98,53.47 U1.26 | v89.53,50.04 89.53,50.17 89.34,50.36 85.91,50.36 SW88.2 v62.36,40 | SW55.2 SW56.2 SW90.2
  Bottom 0.254: v94.11,50.1 94.04,50.04 v89.53,50.04 | SW90.2 v62.36,40
ROW4  (via drill 0.3)
  Top 0.254: U1.12 91.65,59.48 v91.31,59.82 | v32.13,20.95 SW58.2 | SW59.2 SW83.2 72.71,20.95 | SW60.2 72.71,20.95 | 72.71,20.95 72.71,25.4 78.11,30.8 v80.64,30.8 | v80.64,32.7 v80.64,44.13 | v80.33,45.72 v80.33,50.17 | v82.55,57.78 82.55,58.1 84.14,59.69 84.14,60.52 v84.2,60.58
  Bottom 0.254: v91.31,59.82 91.19,59.82 90.68,60.33 90.68,60.71 89.66,61.85 85.47,61.85 v84.2,60.58 | SW59.2 v32.13,20.95 | SW60.2 75.56,21.08 | v80.64,30.8 v80.64,32.7 | v80.64,44.13 80.64,45.4 v80.33,45.72 | v80.33,50.17 80.33,55.56 v82.55,57.78
ROW5
  Top 0.254: U1.30 96,44.97 SW1.2 100.84,40 100.84,33.27 98.55,30.99 98.55,28.77 100.97,26.35 SW2.2
SCLK
  Top 0.254: U1.9 93.5,61.32 93.22,61.59 92.58,61.59 89.92,64.26 89.92,66.42 ISP1.3